# Altium project eco_mthbrd_REV.C1.PrjPcb
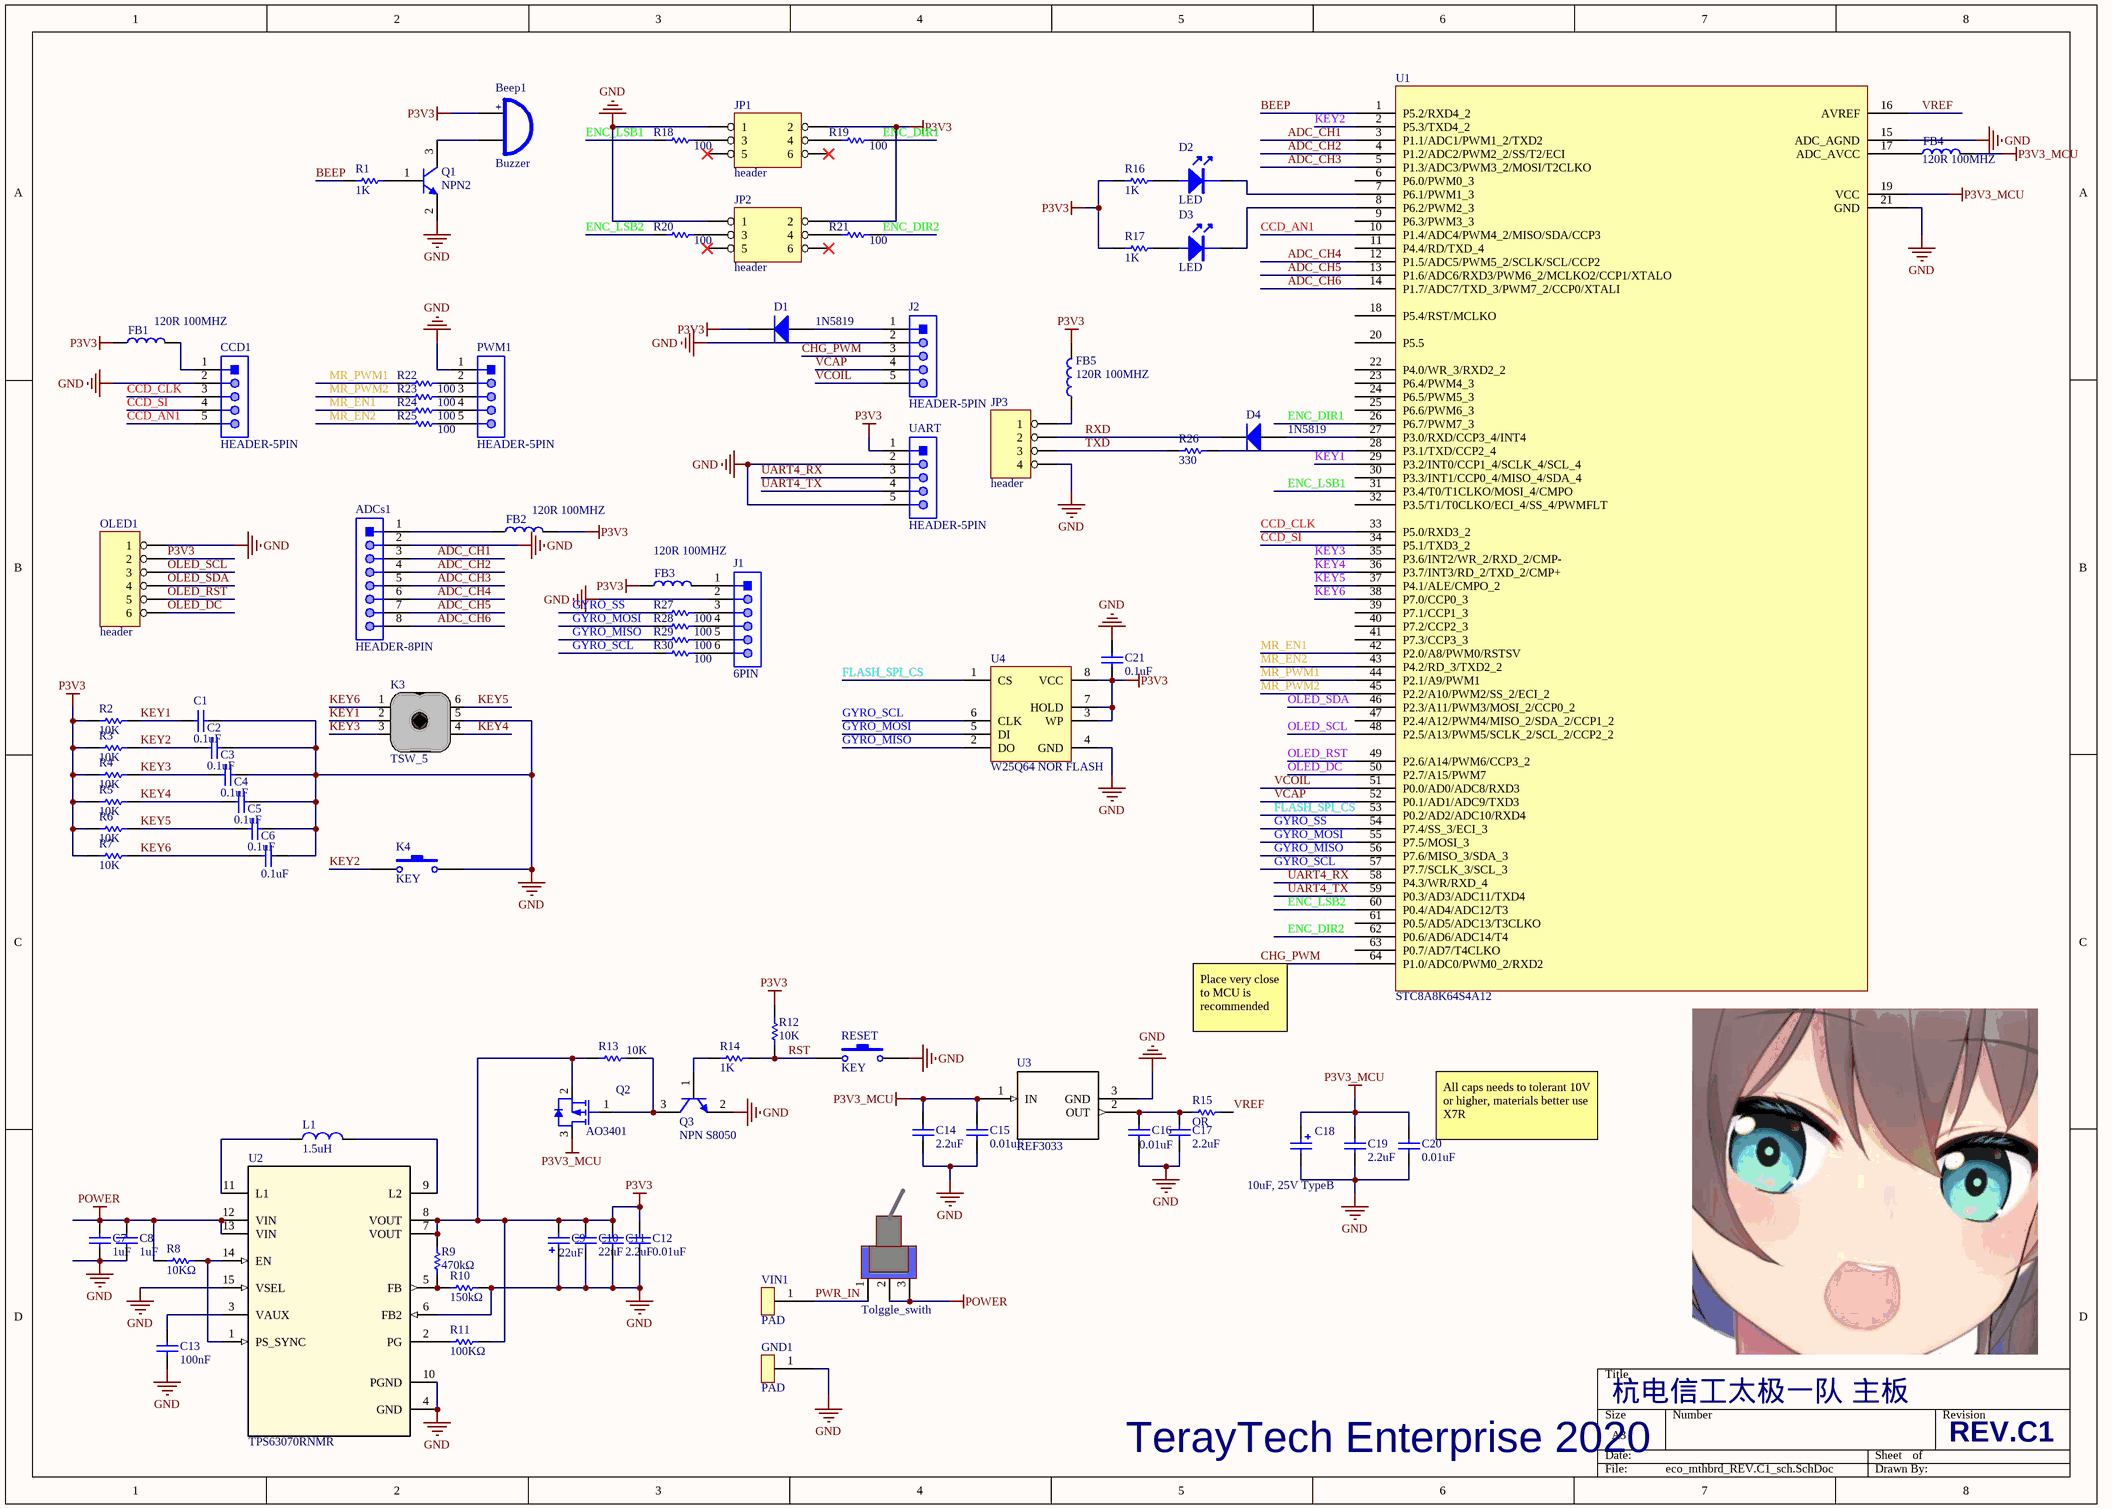
[diagram p0: eco_mthbrd_REV.C1_sch.SchDoc]
1 sheet, 85 parts. Net scope: global (net labels, ports and power ports of the same name join across sheets).
Board files: ECO_mthbrd_REV.2A.PcbDoc, ECO_mthbrd_REV.2A0.PcbDoc

## Sheet eco_mthbrd_REV.C1_sch.SchDoc
size A3

### Parts
ADCs1  HEADER-8PIN  [HEADER_8P_1.25_RT]
Beep1  Buzzer  [BUZZER_9.6*9.6*5mm]
C1  0.1uF  [0603_C]
C2  0.1uF  [0603_C]
C3  0.1uF  [0603_C]
C4  0.1uF  [0603_C]
C5  0.1uF  [0603_C]
C6  0.1uF  [0603_C]
C7  1uF  [C1206]
C8  1uF  [0603_C]
C9  22uF  [CAPC3528B]
C10  22uF  [C1206]
C11  2.2uF  [0603_C]
C12  0.01uF  [0603_C]
C13  100nF  [0603_C]
C14  2.2uF  [0603_C]
C15  0.01uF  [0603_C]
C16  0.01uF  [0603_C]
C17  2.2uF  [0603_C]
C18  10uF, 25V TypeB  [CAPC3528B]
C19  2.2uF  [0603_C]
C20  0.01uF  [0603_C]
C21  0.1uF  [0603_C]
CCD1  HEADER-5PIN  [HEADER_5P_1.25_up]
D1  1N5819  [SOD123]
D2  LED  [0603_LED]
D3  LED  [0603_LED]
D4  1N5819  [SOD123]
Energy1  Tolggle_swith  [TOGGLE SWICH STAND]
FB1  120R 100MHZ  [FB0603]
FB2  120R 100MHZ  [FB0603]
FB3  120R 100MHZ  [FB0603]
FB4  120R 100MHZ  [FB0603]
FB5  120R 100MHZ  [FB0603]
GND1  PAD  [PAD]
J1  6PIN  [MX 1.25-WS-6P]
J2  HEADER-5PIN  [HEADER_5P_1.25_RT]
JP1  header  [header2X3]
JP2  header  [header2X3]
JP3  header  [header4]
K3  TSW_5  [TSW-10]
K4  KEY  [贴片复位开关]
L1  1.5uH  [L 5x5]
OLED1  header  [0.96寸OLED模块]
PWM1  HEADER-5PIN  [HEADER_5P_1.25_RT]
Q1  NPN2  [SOT-23-3]
Q2  AO3401  [SOT-23-3]
Q3  NPN S8050  [SOT-23-3]
R1  1K  [0603_R]
R2  10K  [0603_R]
R3  10K  [0603_R]
R4  10K  [0603_R]
R5  10K  [0603_R]
R6  10K  [0603_R]
R7  10K  [0603_R]
R8  10KΩ  [0603_R]
R9  470kΩ  [0603_R]
R10  150kΩ  [0603_R]
R11  100KΩ  [0603_R]
R12  10K  [0603_R]
R13  10K  [0603_R]
R14  1K  [0603_R]
R15  OR  [0603_R]
R16  1K  [0603_R]
R17  1K  [0603_R]
R18  100  [0603_R]
R19  100  [0603_R]
R20  100  [0603_R]
R21  100  [0603_R]
R22  100  [0603_R]
R23  100  [0603_R]
R24  100  [0603_R]
R25  100  [0603_R]
R26  330  [0603_R]
R27  100  [0603_R]
R28  100  [0603_R]
R29  100  [0603_R]
R30  100  [0603_R]
RESET  KEY  [KEY_2]
U1  STC8A8K64S4A12  [TQFP64]
U2  TPS63070RNMR  [RNM0015A]
U3  REF3033  [DBZ3]
U4  W25Q64 NOR FLASH  [SOIC8]
UART  HEADER-5PIN  [HEADER_5P_1.25_RT]
VIN1  PAD  [PAD]

### Nets
GND: ADCs1.2 C1.2 C2.2 C3.2 C4.2 C5.2 C6.2 C7.1 C8.1 C9.1 C10.1 C11.1 C12.1 C13.1 C14.2 C15.2 C16.1 C17.1 C18.2 C19.1 C20.1 C21.2 CCD1.2 GND1.1 J1.2 J2.2 JP1.1 JP2.1 JP3.4 K3.5 K4.2 OLED1.1 PWM1.1 Q1.2(E) Q3.2(E) R10.1 RESET.2 U1.15(ADC_AGND) U1.21(GND) U2.4(GND) U2.6(FB2) U2.10(PGND) U2.15(VSEL) U3.3(GND) U4.4(GND) UART.2 UART.5
P3V3: Beep1.1(A) C9.2 C10.2 C11.2 C12.2 C21.1 D1.2(K) FB1.1 FB2.2 FB3.1 FB5.2 JP1.2 JP2.2 OLED1.2 Q2.2(S) R2.1 R3.1 R4.1 R5.1 R6.1 R7.1 R9.2 R11.1 R12.1 R13.2 R16.1 R17.1 U2.7(VOUT) U2.8(VOUT) U4.3(WP) U4.7(HOLD) U4.8(VCC) UART.1
P3V3_MCU: C14.1 C15.1 C18.1 C19.2 C20.2 FB4.2 Q2.3(D) U1.19(VCC) U3.1(IN)
POWER: C7.2 C8.2 Energy1.2 Energy1.3 R8.2 U2.12(VIN) U2.13(VIN)
ADC_CH1: ADCs1.3 U1.3(P1.1/ADC1/PWM1_2/TXD2)
ADC_CH2: ADCs1.4 U1.4(P1.2/ADC2/PWM2_2/SS/T2/ECI)
ADC_CH3: ADCs1.5 U1.5(P1.3/ADC3/PWM3_2/MOSI/T2CLKO)
ADC_CH4: ADCs1.6 U1.12(P1.5/ADC5/PWM5_2/SCLK/SCL/CCP2)
ADC_CH5: ADCs1.7 U1.13(P1.6/ADC6/RXD3/PWM6_2/MCLKO2/CCP1/XTALO)
ADC_CH6: ADCs1.8 U1.14(P1.7/ADC7/TXD_3/PWM7_2/CCP0/XTALI)
BEEP: R1.1 U1.1(P5.2/RXD4_2)
CCD_AN1: CCD1.5 U1.10(P1.4/ADC4/PWM4_2/MISO/SDA/CCP3)
CCD_CLK: CCD1.3 U1.33(P5.0/RXD3_2)
CCD_SI: CCD1.4 U1.34(P5.1/TXD3_2)
CHG_PWM: J2.3 U1.64(P1.0/ADC0/PWM0_2/RXD2)
ENC_DIR1: R19.2 U1.26(P6.7/PWM7_3)
ENC_DIR2: R21.2 U1.62(P0.6/AD6/ADC14/T4)
ENC_LSB1: R18.1 U1.31(P3.4/T0/T1CLKO/MOSI_4/CMPO)
ENC_LSB2: R20.1 U1.60(P0.4/AD4/ADC12/T3)
FLASH_SPI_CS: U1.53(P0.2/AD2/ADC10/RXD4) U4.1(CS)
GYRO_MISO: R29.1 U1.56(P7.6/MISO_3/SDA_3) U4.2(DO)
GYRO_MOSI: R28.1 U1.55(P7.5/MOSI_3) U4.5(DI)
GYRO_SCL: R30.1 U1.57(P7.7/SCLK_3/SCL_3) U4.6(CLK)
GYRO_SS: R27.1 U1.54(P7.4/SS_3/ECI_3)
KEY1: C1.1 K3.2 R2.2 U1.29(P3.2/INT0/CCP1_4/SCLK_4/SCL_4)
KEY2: C2.1 K4.1 R3.2 U1.2(P5.3/TXD4_2)
KEY3: C3.1 K3.3 R4.2 U1.35(P3.6/INT2/WR_2/RXD_2/CMP-)
KEY4: C4.1 K3.4 R5.2 U1.36(P3.7/INT3/RD_2/TXD_2/CMP+)
KEY5: C5.1 K3.6 R6.2 U1.37(P4.1/ALE/CMPO_2)
KEY6: C6.1 K3.1 R7.2 U1.38(P7.0/CCP0_3)
MR_EN1: R24.1 U1.42(P2.0/A8/PWM0/RSTSV)
MR_EN2: R25.1 U1.43(P4.2/RD_3/TXD2_2)
MR_PWM1: R22.1 U1.44(P2.1/A9/PWM1)
MR_PWM2: R23.1 U1.45(P2.2/A10/PWM2/SS_2/ECI_2)
OLED_DC: OLED1.6 U1.50(P2.7/A15/PWM7)
OLED_RST: OLED1.5 U1.49(P2.6/A14/PWM6/CCP3_2)
OLED_SCL: OLED1.3 U1.48(P2.5/A13/PWM5/SCLK_2/SCL_2/CCP2_2)
OLED_SDA: OLED1.4 U1.46(P2.3/A11/PWM3/MOSI_2/CCP0_2)
PWR_IN: Energy1.1 VIN1.1
RST: R12.2 R14.2 RESET.1
RXD: D4.2(K) JP3.2
TXD: JP3.3 R26.1
UART4_RX: U1.58(P4.3/WR/RXD_4) UART.3
UART4_TX: U1.59(P0.3/AD3/ADC11/TXD4) UART.4
VCAP: J2.4 U1.52(P0.1/AD1/ADC9/TXD3)
VCOIL: J2.5 U1.51(P0.0/AD0/ADC8/RXD3)
VREF: R15.2 U1.16(AVREF)
NetADCs1_1: ADCs1.1 FB2.1
NetBeep1_2: Beep1.2(B) Q1.3(C)
NetC13_2: C13.2 U2.3(VAUX)
NetC16_2: C16.2 C17.2 R15.1 U3.2(OUT)
NetCCD1_1: CCD1.1 FB1.2
NetD1_1: D1.1(A) J2.1
NetD2_1: D2.1(A) R16.2
NetD2_2: D2.2(K) U1.7(P6.1/PWM1_3)
NetD3_1: D3.1(A) R17.2
NetD3_2: D3.2(K) U1.8(P6.2/PWM2_3)
NetD4_1: D4.1(A) U1.27(P3.0/RXD/CCP3_4/INT4)
NetFB3_2: FB3.2 J1.1
NetFB4_1: FB4.1 U1.17(ADC_AVCC)
NetFB5_1: FB5.1 JP3.1
NetJ1_3: J1.3 R27.2
NetJ1_4: J1.4 R28.2
NetJ1_5: J1.5 R29.2
NetJ1_6: J1.6 R30.2
NetJP1_3: JP1.3 R18.2
NetJP1_4: JP1.4 R19.1
NetJP2_3: JP2.3 R20.2
NetJP2_4: JP2.4 R21.1
NetL1_1: L1.1 U2.11(L1)
NetL1_2: L1.2 U2.9(L2)
NetPWM1_2: PWM1.2 R22.2
NetPWM1_3: PWM1.3 R23.2
NetPWM1_4: PWM1.4 R24.2
NetPWM1_5: PWM1.5 R25.2
NetQ1_1: Q1.1(B) R1.2
NetQ2_1: Q2.1(G) Q3.3(C) R13.1
NetQ3_1: Q3.1(B) R14.1
NetR8_1: R8.1 U2.1(PS_SYNC) U2.14(EN)
NetR9_1: R9.1 R10.2 U2.5(FB)
NetR11_2: R11.2 U2.2(PG)
NetR26_2: R26.2 U1.28(P3.1/TXD/CCP2_4)

Not connected (* = marked no-connect by the designer): JP1 5* 6*; JP2 5* 6*; U1 6(P6.0/PWM0_3) 9(P6.3/PWM3_3) 11(P4.4/RD/TXD_4) 18(P5.4/RST/MCLKO) 20(P5.5) 22(P4.0/WR_3/RXD2_2) 23(P6.4/PWM4_3) 24(P6.5/PWM5_3) 25(P6.6/PWM6_3) 30(P3.3/INT1/CCP0_4/MISO_4/SDA_4) 32(P3.5/T1/T0CLKO/ECI_4/SS_4/PWMFLT) 39(P7.1/CCP1_3) 40(P7.2/CCP2_3) 41(P7.3/CCP3_3) 47(P2.4/A12/PWM4/MISO_2/SDA_2/CCP1_2) 61(P0.5/AD5/ADC13/T3CLKO) 63(P0.7/AD7/T4CLKO)

### Notes on the sheet
- Place very close to MCU is recommended
- (near C20) All caps needs to tolerant 10V or higher, materials better use X7R
- TerayTech Enterprise 2020
- 杭电信工太极一队 主板
- REV.C1
- (in symbol Buzzer) +

### Library data of the parts
C1-C8 C10-C17 C19-C21 = CAP: Capacitor; Value: 104; Published: 8-Jun-2000; LatestRevisionDate: 17-Jul-2002; LatestRevisionNote: Re-released for DXP Platform.; PackageReference: RAD-0.3; Publisher: Altium Limited
C9 C18 = CAP_tan: Capacitor; Value: 104; Published: 8-Jun-2000; LatestRevisionDate: 17-Jul-2002; LatestRevisionNote: Re-released for DXP Platform.; PackageReference: RAD-0.3; Publisher: Altium Limited
D1 D4 = 1N5819: 40V 1A PEAK 25a
D2 D3 = LED: LED 发光二极管
FB1-FB5 = FB: 120OHM@100MHZ 2A 25% 0603
J1 = HEADER-6PIN
JP1 JP2 = HEADER 3X2
JP3 = HEADER 4
K3 = TSW_5: 方向开关
K4 RESET = KEY_2: Switch; Published: 24-Mar-1999; LatestRevisionDate: 17-Jul-2002; LatestRevisionNote: Re-released for DXP Platform.; PackageReference: SPST-2; Publisher: Altium Limited
L1 = Inductor
OLED1 = HEADER 6
Q1 Q3 = NPN2: 贴片
Q2 = p-MOSEFT_SMALL
R1 = RES: Resistor; Published: 8-Jun-2000; Revision: July-2002: Re-released for DXP Platform.; Publisher: Altium Limited; Value: 1K
R2-R13 R15 R18-R30 = RES0: Resistor; Value: 1K; Published: 8-Jun-2000; Revision: July-2002: Re-released for DXP Platform.; Publisher: Altium Limited
R14 R16 R17 = RES0: Resistor; Published: 8-Jun-2000; Revision: July-2002: Re-released for DXP Platform.; Publisher: Altium Limited; Value: 1K
U1 = STC8A8K64S4A12_LQFP64
U2 = TPS63070RNMR: Imported; Manufacturer: Texas Instruments; PartNumber: TPS63070RNMR; RefDes: RefDes; Type: TYPE; Value: Value
U3 = REF3033_DBZ_3: Imported; Manufacturer: Texas Instruments; INDUSTRY_STD_PKG_TYPE: SOT-23; FAMILY_NAME: SERIES VOLTAGE REFERENCE; PIN_COUNT: 3; PACKAGE_DESIGNATOR: DBZ; Datasheet URL: http://www.ti.com/lit/gpn/REF3033; GENERIC_PART_NUMBER: REF3033; Vendor: Texas Instruments; Manufacturer_Part_Number: ref3033_dbz_3; RefDes: RefDes; Type: DEV; Value: Value
U4 = w25qxx